# EAGLE design ESP32Shield (EAGLE 9.1.3)
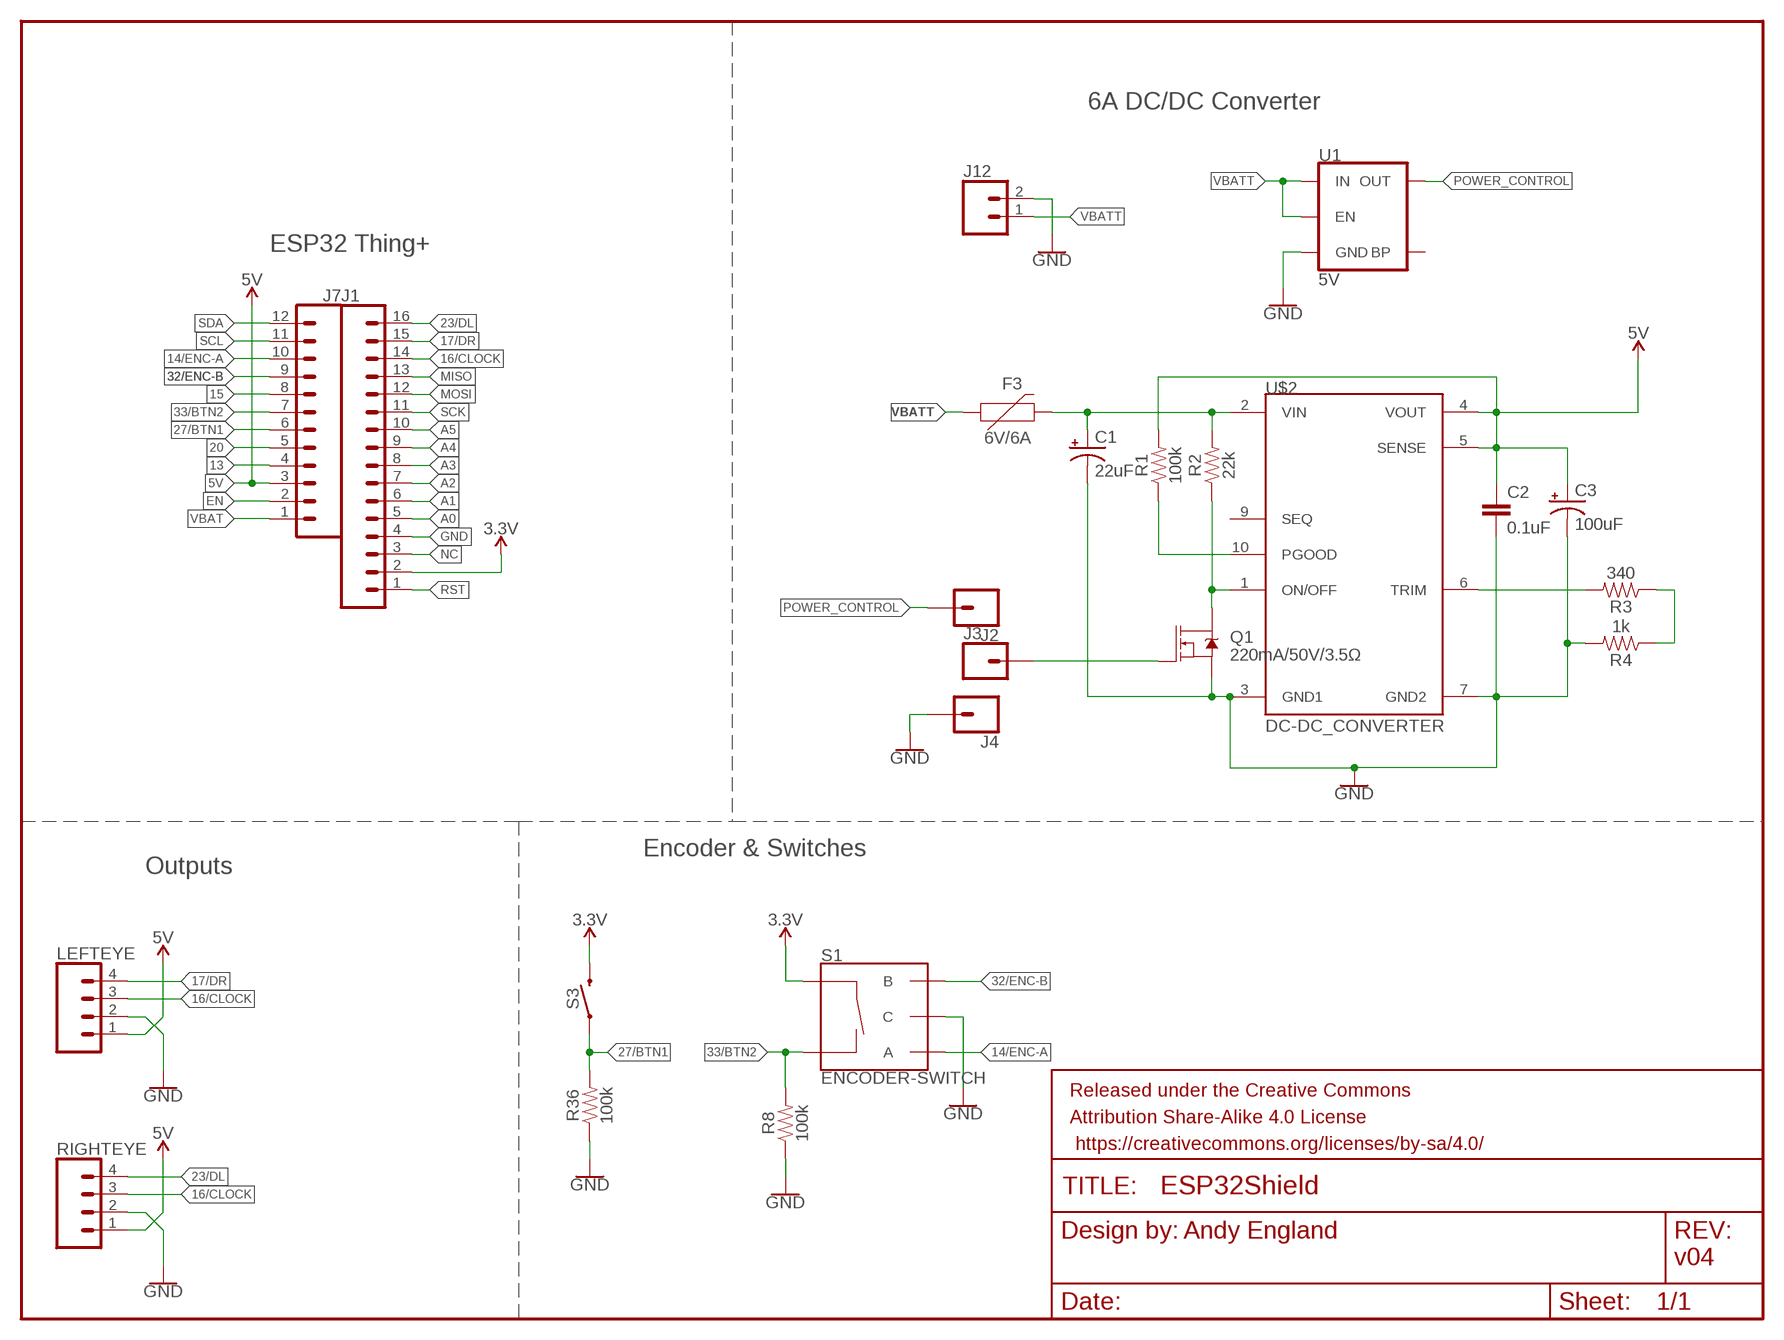
[diagram p0: schematic, sheet 1]

## Parts
C1  22uF  22UF-POLAR-PANASONIC_C-35V-20%  [PANASONIC_C]
C2  0.1uF  0.1UF-0603-25V-5%  [0603]
C3  100uF  100UF-POLAR-25V-20%(ELEC)  [PANASONIC_D]
F3  6V/6A  PPTC_HALF-AMP  [1206]
FRAME1  FRAME-LETTER  [CREATIVE_COMMONS]
J1  CONN_161X16_NO_SILK  [1X16_NO_SILK]
J2  CONN_01  [1X01]
J3  CONN_01  [1X01]
J4  CONN_01  [1X01]
J7  CONN_12NO_SILK  [1X12_NO_SILK]
J12  CONN_025MM  [SCREWTERMINAL-5MM-2]
LEFTEYE  CONN_041X04_NO_SILK  [1X04_NO_SILK]
Q1  220mA/50V/3.5Ω  MOSFET-NCH-BSS138  [SOT23-3]
R1  100k  100KOHM-0603-1/10W-1%  [0603]
R2  22k  22KOHM-0603-1/10W-1%  [0603]
R3  340  340OHM-0603-1/10W-1%  [0603]
R4  1k  1KOHM-0603-1/10W-1%  [0603]
R8  100k  100KOHM-0603-1/10W-1%  [0603]
R36  100k  100KOHM-0603-1/10W-1%  [0603]
RIGHTEYE  CONN_041X04_NO_SILK  [1X04_NO_SILK]
S1  ENCODER-SWITCH  [ROTARY_ENC_PLAIN]
S3  MOMENTARY-SWITCH-SPST-SMD-5.2-REDUNDANT  [TACTILE_SWITCH_SMD_5.2MM]
U1  5V  V_REG_MIC52055V  [SOT23-5]
U$2  DC-DC_CONVERTER  [DC-DC_CONVERTER]

## Nets
3.3V: J1.2 S1.SW+ S3.3 S3.4
5V: C2.1 C3.+ J7.3 LEFTEYE.1 R1.2 RIGHTEYE.1 U$2.4(VOUT) U$2.5(SENSE)
13: J7.4
14/ENC-A: J7.10 S1.A
15: J7.8
16/CLOCK: J1.14 LEFTEYE.3 RIGHTEYE.3
17/DR: J1.15 LEFTEYE.4
20: J7.5
23/DL: J1.16 RIGHTEYE.4
27/BTN1: J7.6 R36.2 S3.1 S3.2
32/ENC-B: J7.9 S1.B
33/BTN2: J7.7 R8.2 S1.SW-
A0: J1.5
A1: J1.6
A2: J1.7
A3: J1.8
A4: J1.9
A5: J1.10
EN: J7.2
GND: C1.- C2.2 C3.- J1.4 J4.1 J12.2 LEFTEYE.2 Q1.2(S) R4.2 R8.1 R36.1 RIGHTEYE.2 S1.C U1.2(GND) U$2.3(GND1) U$2.7(GND2)
MISO: J1.13
MOSI: J1.12
N$1: J3.1 Q1.1(G)
N$2: C1.+ F3.2 R2.2 U$2.2(VIN)
N$3: Q1.3(D) R2.1 U$2.1(ON/OFF)
N$4: R3.2 U$2.6(TRIM)
N$5: R3.1 R4.1
NC: J1.3
PGOOD3: R1.1 U$2.10(PGOOD)
POWER_CONTROL: J2.1 U1.5(OUT)
RST: J1.1
SCK: J1.11
SCL: J7.11
SDA: J7.12
VBAT: J7.1
VBATT: F3.1 J12.1 U1.1(IN) U1.3(EN)
Unconnected: U1.4(BP) U$2.9(SEQ)

## Notes on the sheet
- 6A DC/DC Converter
- ESP32 Thing+
- Encoder & Switches
- Outputs
- Andy England
- v04

## Library data of the parts
C1 = SparkFun-Capacitors:22UF-POLAR: 22µF polarized capacitors A capacitor is a passive two-terminal electrical component used to store electrical energy temporarily in an electric field.; PROD_ID: CAP-08618
C2 = SparkFun-Capacitors:0.1UF: 0.1µF ceramic capacitors A capacitor is a passive two-terminal electrical component used to store electrical energy temporarily in an electric field.; PROD_ID: CAP-08604
C3 = SparkFun-Capacitors:100UF-POLAR: 100µF polarized capacitors A capacitor is a passive two-terminal electrical component used to store electrical energy temporarily in an electric field.; PROD_ID: CAP-12547
F3 = SparkFun-Fuses:PPTC: Resettable Fuse PPTC Resettable Fuse. Really a sort of resistor with a polymeric positive temperature coefficient whose resistance increases dramatically with an increase in temperature. When heated by the power passing through the resistance rises causing the current to be limited, protecting the circuit. This is achieved by the transition of the polymer from a crystalline to an amorphous state where the conductive carbon separates breaking the conductive pathways found in the cool crystalline structure. When a PPTC cools back down it resumes conducting letting the circuit turn back on. SparkFun Products: SparkFun RedBoard - Programmed with Arduino <https://www.sparkfun.com/products/12757> Pro Micro - 5V/16MHz <https://www.sparkfun.com/products/12640> Arduino Pro 328 - 5V/16MHz <https://www.sparkfun.com/products/10915> MP3 Trigger <https://www.sparkfun.com/products/13720>; PROD_ID: RES-08585; VALUE: 6V/0.5A
FRAME1 = SparkFun-Aesthetics:FRAME-LETTER: Schematic Frame - Letter Standard 8.5x11 US Letter frame
J1 = SparkFun-Connectors:CONN_16: Multi connection point. Often used as Generic Header-pin footprint for 0.1 inch spaced/style header connections On any of the 0.1 inch spaced packages, you can populate with these: Break Away Headers - Straight <https://www.sparkfun.com/products/116> (PRT-00116) Break Away Male Headers - Right Angle <https://www.sparkfun.com/products/553> (PRT-00553) Female Headers <https://www.sparkfun.com/products/115> (PRT-00115) Break Away Headers - Machine Pin <https://www.sparkfun.com/products/117> (PRT-00117) Break Away Female Headers - Swiss Machine Pin <https://www.sparkfun.com/products/743> (PRT-00743) For SCREWTERMINALS and SPRING TERMINALS visit here: Screw Terimnals on SparkFun.com <https://www.sparkfun.com/search/results?term=Screw+Terminals> (5mm/3.5mm/2.54mm spacing) This device is also useful as a general connection point to wire up your design to another part of your project. Our various solder wires solder well into these plated through hole pads. Hook-Up Wire - Assortment (Stranded, 22 AWG) <https://www.sparkfun.com/products/11375> (PRT-11375) Hook-Up Wire - Assortment (Solid Core, 22 AWG) <https://www.sparkfun.com/products/11367> (PRT-11367) View the entire wire category on our website here <https://www.sparkfun.com/categories/141> Special notes: Molex polarized connector foot print use with SKU : PRT-08231 with associated crimp pins and housings. 1MM SMD Version SKU: PRT-10208 NOTES ON THE VARIANTS LOCK and LOCK_LONGPADS... This footprint was designed to help hold the alignment of a through-hole component (i.e. 6-pin header) while soldering it into place. You may notice that each hole has been shifted either up or down by 0.005 of an inch from it's more standard position (which is a perfectly straight line). This slight alteration caused the pins (the squares in the middle) to touch the edges of the holes. Because they are alternating, it causes a "brace" to hold the component in place. 0.005 has proven to be the perfect amount of "off-center" position when using our standard breakaway headers. Although looks a little odd when you look at the bare footprint, once you have a header in there, the alteration is very hard to notice. Also,if you push a header all the way into place, it is covered up entirely on the bottom side.
J2-J4 = SparkFun-Connectors:CONN_01: Single connection point. Often used as Generic Header-pin footprint for 0.1 inch spaced/style header connections On any of the 0.1 inch spaced packages, you can populate with these: Break Away Headers - Straight <https://www.sparkfun.com/products/116> (PRT-00116) Break Away Male Headers - Right Angle <https://www.sparkfun.com/products/553> (PRT-00553) Female Headers <https://www.sparkfun.com/products/115> (PRT-00115) Break Away Headers - Machine Pin <https://www.sparkfun.com/products/117> (PRT-00117) Break Away Female Headers - Swiss Machine Pin <https://www.sparkfun.com/products/743> (PRT-00743) This device is also useful as a general connection point to wire up your design to another part of your project. Our various solder wires solder well into these plated through hole pads. Hook-Up Wire - Assortment (Stranded, 22 AWG) <https://www.sparkfun.com/products/11375> (PRT-11375) Hook-Up Wire - Assortment (Solid Core, 22 AWG) <https://www.sparkfun.com/products/11367> (PRT-11367) View the entire wire category on our website here <https://www.sparkfun.com/categories/141> Special notes: SMTSO-256-ET is a "flush mount" nut for a 4-40 screw. We mostly use this on specialty testbeds; it is a nice way to connect hardware to your PCB at an adjustable hieght. Also note, the SNAP packages are for using a snappable style connector. We sell a baggie of snaps and they are also used on two LilyPad designs: Snap Assortment - 30 pack (male and female) <https://www.sparkfun.com/products/11347> (DEV-11347) LilyPad Arduino SimpleSnap <https://www.sparkfun.com/products/10941> (DEV-10941) LilyPad SimpleSnap Protoboard <https://www.sparkfun.com/products/10940> (DEV-10940)
J7 = SparkFun-Connectors:CONN_12: Multi connection point. Often used as Generic Header-pin footprint for 0.1 inch spaced/style header connections On any of the 0.1 inch spaced packages, you can populate with these: Break Away Headers - Straight <https://www.sparkfun.com/products/116> (PRT-00116) Break Away Male Headers - Right Angle <https://www.sparkfun.com/products/553> (PRT-00553) Female Headers <https://www.sparkfun.com/products/115> (PRT-00115) Break Away Headers - Machine Pin <https://www.sparkfun.com/products/117> (PRT-00117) Break Away Female Headers - Swiss Machine Pin <https://www.sparkfun.com/products/743> (PRT-00743) For SCREWTERMINALS and SPRING TERMINALS visit here: Screw Terimnals on SparkFun.com <https://www.sparkfun.com/search/results?term=Screw+Terminals> (5mm/3.5mm/2.54mm spacing) This device is also useful as a general connection point to wire up your design to another part of your project. Our various solder wires solder well into these plated through hole pads. Hook-Up Wire - Assortment (Stranded, 22 AWG) <https://www.sparkfun.com/products/11375> (PRT-11375) Hook-Up Wire - Assortment (Solid Core, 22 AWG) <https://www.sparkfun.com/products/11367> (PRT-11367) View the entire wire category on our website here <https://www.sparkfun.com/categories/141> Special notes: Molex polarized connector foot print use with SKU : PRT-08231 with associated crimp pins and housings. 1MM SMD Version SKU: PRT-10208 NOTES ON THE VARIANTS LOCK and LOCK_LONGPADS... This footprint was designed to help hold the alignment of a through-hole component (i.e. 6-pin header) while soldering it into place. You may notice that each hole has been shifted either up or down by 0.005 of an inch from it's more standard position (which is a perfectly straight line). This slight alteration caused the pins (the squares in the middle) to touch the edges of the holes. Because they are alternating, it causes a "brace" to hold the component in place. 0.005 has proven to be the perfect amount of "off-center" position when using our standard breakaway headers. Although looks a little odd when you look at the bare footprint, once you have a header in there, the alteration is very hard to notice. Also,if you push a header all the way into place, it is covered up entirely on the bottom side.
J12 = SparkFun-Connectors:CONN_02: Multi connection point. Often used as Generic Header-pin footprint for 0.1 inch spaced/style header connections On any of the 0.1 inch spaced packages, you can populate with these: Break Away Headers - Straight <https://www.sparkfun.com/products/116> (PRT-00116) Break Away Male Headers - Right Angle <https://www.sparkfun.com/products/553> (PRT-00553) Female Headers <https://www.sparkfun.com/products/115> (PRT-00115) Break Away Headers - Machine Pin <https://www.sparkfun.com/products/117> (PRT-00117) Break Away Female Headers - Swiss Machine Pin <https://www.sparkfun.com/products/743> (PRT-00743) For SCREWTERMINALS and SPRING TERMINALS visit here: Screw Terimnals on SparkFun.com <https://www.sparkfun.com/search/results?term=Screw+Terminals> (5mm/3.5mm/2.54mm spacing) This device is also useful as a general connection point to wire up your design to another part of your project. Our various solder wires solder well into these plated through hole pads. Hook-Up Wire - Assortment (Stranded, 22 AWG) <https://www.sparkfun.com/products/11375> (PRT-11375) Hook-Up Wire - Assortment (Solid Core, 22 AWG) <https://www.sparkfun.com/products/11367> (PRT-11367) View the entire wire category on our website here <https://www.sparkfun.com/categories/141> Special notes: Molex polarized connector foot print use with: PRT-08233 with associated crimp pins and housings. 2.54_SCREWTERM for use with PRT-10571. 3.5mm Screw Terminal footprints for PRT-08084 5mm Screw Terminal footprints for use with PRT-08432; SF_SKU: PRT-08432
LEFTEYE RIGHTEYE = SparkFun-Connectors:CONN_04: Multi connection point. Often used as Generic Header-pin footprint for 0.1 inch spaced/style header connections On any of the 0.1 inch spaced packages, you can populate with these: Break Away Headers - Straight <https://www.sparkfun.com/products/116> (PRT-00116) Break Away Male Headers - Right Angle <https://www.sparkfun.com/products/553> (PRT-00553) Female Headers <https://www.sparkfun.com/products/115> (PRT-00115) Break Away Headers - Machine Pin <https://www.sparkfun.com/products/117> (PRT-00117) Break Away Female Headers - Swiss Machine Pin <https://www.sparkfun.com/products/743> (PRT-00743) For SCREWTERMINALS and SPRING TERMINALS visit here: Screw Terimnals on SparkFun.com <https://www.sparkfun.com/search/results?term=Screw+Terminals> (5mm/3.5mm/2.54mm spacing) This device is also useful as a general connection point to wire up your design to another part of your project. Our various solder wires solder well into these plated through hole pads. Hook-Up Wire - Assortment (Stranded, 22 AWG) <https://www.sparkfun.com/products/11375> (PRT-11375) Hook-Up Wire - Assortment (Solid Core, 22 AWG) <https://www.sparkfun.com/products/11367> (PRT-11367) View the entire wire category on our website here <https://www.sparkfun.com/categories/141> Special notes: Molex polarized connector foot print use with SKU : PRT-08231 with associated crimp pins and housings. 1MM SMD Version SKU: PRT-10208; PROD_ID: CONN-09696
Q1 = SparkFun-DiscreteSemi:MOSFET-NCH: N-channel MOSFETs Voltage controlled devices that allow control of high current outputs. SparkFun Products: SparkFun OpenScale <https://www.sparkfun.com/products/13261> SparkFun Digital Sandbox <https://www.sparkfun.com/products/12651> SparkFun Monster Moto Shield <https://www.sparkfun.com/products/10182> SparkFun MOSFET Power Controller <https://www.sparkfun.com/products/11214>; PROD_ID: TRANS-00830
R1 R8 R36 = SparkFun-Resistors:100KOHM: 100kΩ resistor A resistor is a passive two-terminal electrical component that implements electrical resistance as a circuit element. Resistors act to reduce current flow, and, at the same time, act to lower voltage levels within circuits. - Wikipedia; PROD_ID: RES-07828
R2 = SparkFun-Resistors:22KOHM: 22kΩ resistor A resistor is a passive two-terminal electrical component that implements electrical resistance as a circuit element. Resistors act to reduce current flow, and, at the same time, act to lower voltage levels within circuits. - Wikipedia; PROD_ID: RES-07853
R3 = SparkFun-Resistors:340OHM: 340Ω resistor A resistor is a passive two-terminal electrical component that implements electrical resistance as a circuit element. Resistors act to reduce current flow, and, at the same time, act to lower voltage levels within circuits. - Wikipedia; PROD_ID: RES-12616
R4 = SparkFun-Resistors:1KOHM: 1kΩ resistor A resistor is a passive two-terminal electrical component that implements electrical resistance as a circuit element. Resistors act to reduce current flow, and, at the same time, act to lower voltage levels within circuits. - Wikipedia; PROD_ID: RES-07856
S1 = SparkFun-Switches:ENCODER-SWITCH: Rotary Encoder w/ Select Switch Encoders rotate similarly to potentiometers, but they’re different from potentiometers in that an encoder has full rotation without limits. They output gray code so that you can tell how much and in which direction the encoder has been turned. This encoder includes a push-down select switch built into the shaft. SparkFun Products Rotary Encoder <https://www.sparkfun.com/products/9117> (COM-09117); SF_SKU: COM-09117
S3 = SparkFun-Switches:MOMENTARY-SWITCH-SPST: Momentary Switch (Pushbutton) - SPST Normally-open (NO) SPST momentary switches (buttons, pushbuttons). Variants PTH-12MM - 12mm square, through-hole Momentary Pushbutton Switch - 12mm Square <https://www.sparkfun.com/products/9190> (COM-09190) PTH-6.0MM, PTH-6.0MM-KIT - 6.0mm square, through-hole Mini Pushbutton Switch <https://www.sparkfun.com/products/97> (COM-00097) KIT package intended for soldering kit's - only one side of pads' copper is exposed. PTH-RIGHT-ANGLE-KIT - Right-angle, through-hole Right Angle Tactile Button <https://www.sparkfun.com/products/10791> - Used on SparkFun BigTime Watch Kit <https://www.sparkfun.com/products/11734> SMD-12MM - 12mm square, surface-mount Tactile Button - SMD (12mm) <https://www.sparkfun.com/products/12993> (COM-12993) Used on SparkFun PicoBoard <https://www.sparkfun.com/products/11888> SMD-4.5MM - 4.5mm Square Trackball Switch Used on SparkFun Blackberry Trackballer Breakout <https://www.sparkfun.com/products/13169> SMD-4.6MMX2.8MM - 4.60mm x 2.80mm, surface mount Used on SparkFun SAMD21 Mini Breakout <https://www.sparkfun.com/products/13664> SMD-5.2MM, SMD-5.2-REDUNDANT - 5.2mm square, surface-mount Mini Pushbutton Switch - SMD <https://www.sparkfun.com/products/8720> (COM-08720) Used on Arduino Pro Mini <https://www.sparkfun.com/products/11114> REDUNDANT package connects both switch circuits together SMD-6.0X3.5MM - 6.0 x 3.5mm, surface mount Momentary Reset Switch SMD <https://www.sparkfun.com/products/8229> (COM-08229) SMD-6.2MM-TALL - 6.2mm square, surface mount Tactile Button - SMD (6mm) <https://www.sparkfun.com/products/12992> Used on SparkFun Digital Sandbox <https://www.sparkfun.com/products/12651> SMD-RIGHT-ANGLE - Right-angle, surface mount Used on SparkFun Block for Intel® Edison - Arduino <https://www.sparkfun.com/products/13036>; PROD_ID: SWCH-08247; SF_SKU: COM-08720
U1 = SparkFun-IC-Power:V_REG_MIC5205: V_REG MIC5205 Standard 3.3V, 5V, and Adjustable 150mA LDO voltage regulator in SOT-23 layout. Micrel part MIC5205. BP (by-pass) pin is used to lower output noise with 470pF cap, may be left open. On the adjustable version BP is used to set output.; PROD_ID: VREG-00823
U$2 = SparkFun-IC-Power:DC-DC_CONVERTER: APTS006A0X-SRZ (IC-09258) Step-down 6A variable voltage switching module (TOL-09275)

## Board
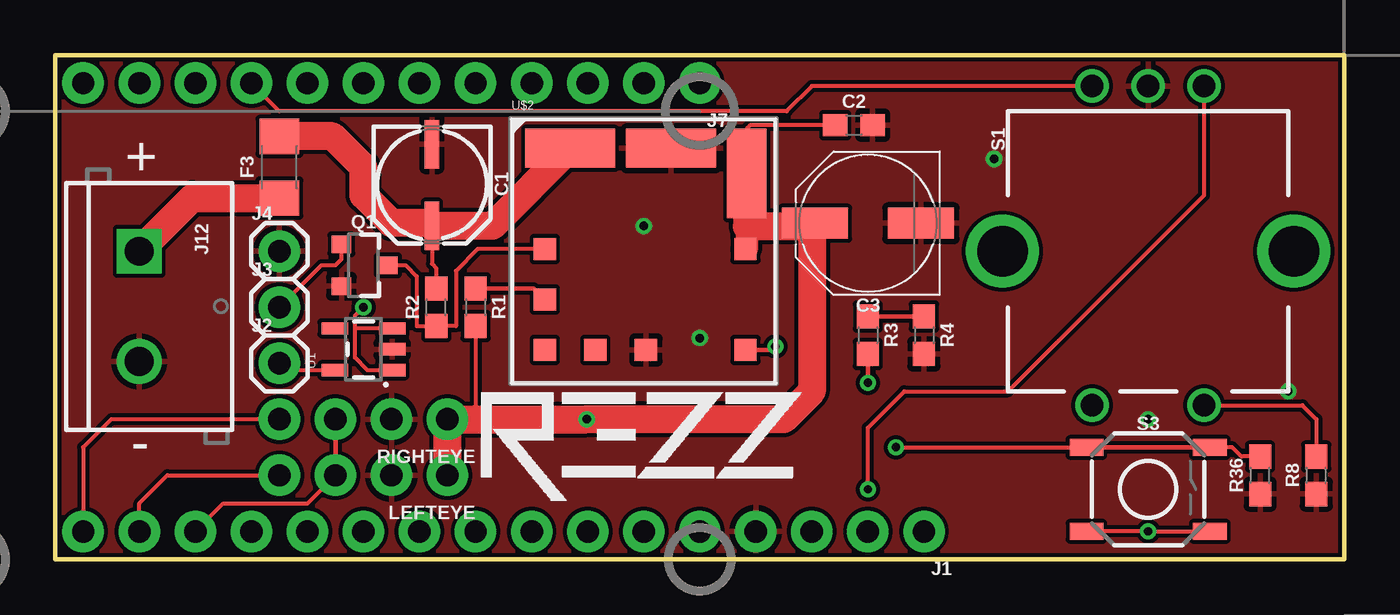
[diagram p1: board, top side]
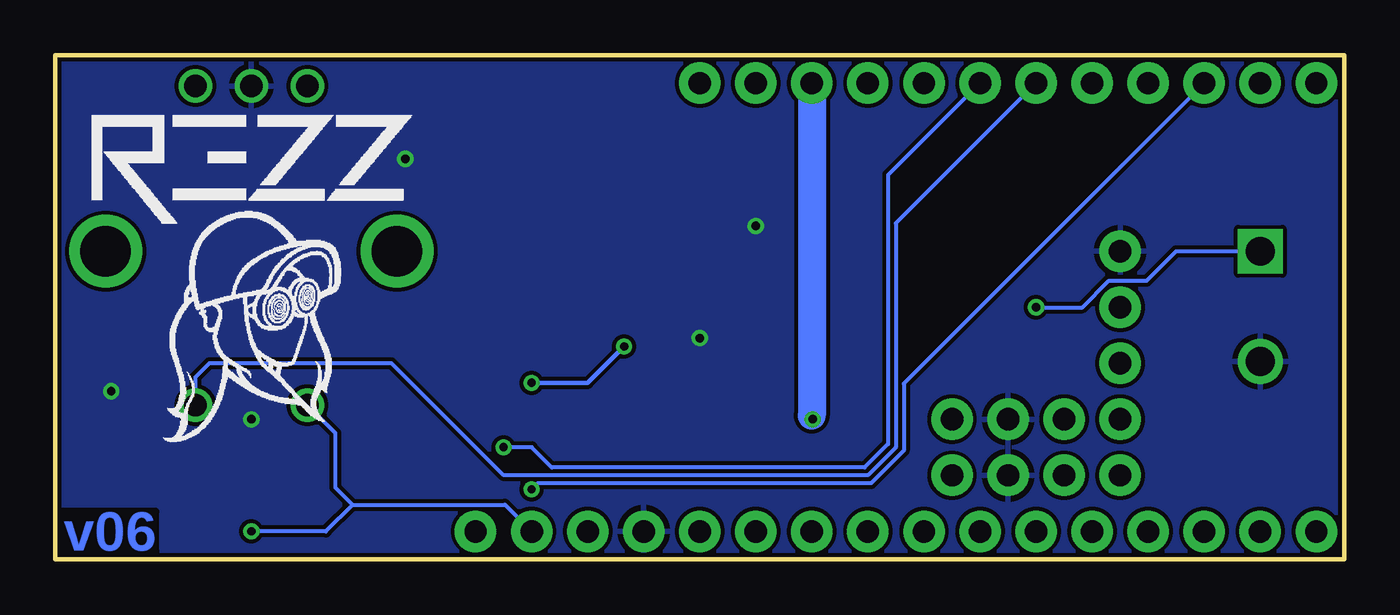
[diagram p2: board, bottom side, seen from below]

Size 58.42 x 22.86 mm. Coordinates in mm from the lower left corner, seen from the top.
Outline: 0,0 58.42,0 58.42,22.86 0,22.86 0,0
Copper layers (1*16): Top 0.035mm / dielectric 1.5mm / Bottom 0.035mm
Design rules "SparkFun-2-layer-TIGHT": minimum track width 7mil, minimum drill 15mil, track to track 7mil, track to pad 7mil, pad to pad 7mil, via to via 7mil, smd to smd 7mil, copper to edge 7mil, drill to drill 7mil, minimum pad ring 7mil, minimum via ring 7mil, stop-mask expansion 4mil, vias tented up to drill 25mil, thermal gap 10mil

### Footprints (pad centres in the part's own frame; a part is rotated, then mirrored left to right if it is on the bottom)
PANASONIC_C = smd 2.2 x 0.65: + 1.9,-0.2; - -1.8,-0.2
0603 = smd 1.1 x 1: 1 -0.85,0; 2 0.85,0
PANASONIC_D = smd 3 x 1.4: + 2.4,0; - -2.4,0
1206 = smd 1.6 x 1.8: 1 -1.4,0; 2 1.4,0
1X16_NO_SILK = drill 1.016 pad 1.88: 1 0,0; 2 2.54,0; 3 5.08,0; 4 7.62,0; 5 10.16,0; 6 12.7,0; 7 15.24,0; 8 17.78,0; 9 20.32,0; 10 22.86,0; 11 25.4,0; 12 27.94,0; 13 30.48,0; 14 33.02,0; 15 35.56,0; 16 38.1,0
1X01 = drill 1.016 pad 1.88: 1 0,0
1X12_NO_SILK = drill 1.016 pad 1.88: 1 0,0; 2 2.54,0; 3 5.08,0; 4 7.62,0; 5 10.16,0; 6 12.7,0; 7 15.24,0; 8 17.78,0; 9 20.32,0; 10 22.86,0; 11 25.4,0; 12 27.94,0
SCREWTERMINAL-5MM-2 = drill 1.3 pad 2.032 square: 1 0,0 | drill 1.3 pad 2.032: 2 5,0
1X04_NO_SILK = drill 1.016 pad 1.88: 1 0,0; 2 2.54,0; 3 5.08,0; 4 7.62,0
SOT23-3 = smd 0.8 x 0.9: 1 -0.95,-1; 2 0.95,-1; 3 0,1.1
ROTARY_ENC_PLAIN = drill 1.016: A 7.493,-2.54; B 7.493,2.54; C 7.493,0; SW+ -6.985,2.54; SW- -6.985,-2.54 | drill 2.286: P$3 0,6.604; P$4 0,-6.604
TACTILE_SWITCH_SMD_5.2MM = smd 1.524 x 0.762: 1 -2.794,1.905; 2 2.794,1.905; 3 -2.794,-1.905; 4 2.794,-1.905
SOT23-5 = smd 0.55 x 1.2: 1 -0.95,-1.3; 2 0,-1.3; 3 0.95,-1.3; 4 0.95,1.3; 5 -0.95,1.3
DC-DC_CONVERTER = smd 1.01 x 1.01: 1 -4.48,0.1; 5 4.61,0.1; 6 4.61,-4.48; 7 0.1,-4.48; 8 -2.19,-4.48; 9 -4.48,-4.48; 10 -4.48,-2.19 | smd 4.07 x 1.77: 2 -3.33,4.67; 3 1.24,4.67 | smd 1.77 x 4.07: 4 4.67,3.53

### Placement (x,y rotation side)
C1  17.27,17.02 270 top
C2  36.2,19.68 0 top
C3  36.83,15.24 180 top
F3  10.16,17.78 90 top
FRAME1  -2.54,-7.62 0 top  (outside the outline)
J1  39.37,1.27 180 top
J2  10.16,8.89 0 top
J3  10.16,11.43 0 top
J4  10.16,13.97 0 top
J7  29.21,21.59 180 top
J12  3.81,13.97 270 top
LEFTEYE  17.78,3.81 180 top
Q1  13.97,13.34 270 top
R1  19.05,11.43 270 top
R2  17.27,11.43 90 top
R3  36.83,10.16 270 top
R4  39.37,10.16 270 top
R8  57.15,3.81 90 top
R36  54.61,3.81 90 top
RIGHTEYE  17.78,6.35 180 top
S1  49.53,13.97 90 top
S3  49.53,3.17 0 top
U1  13.97,9.53 90 top
U$1  [SWBADNC#JPG]  26.57,5.11 0 top
U$2  26.67,13.97 0 top
U$3  [FB847930393B0F397FC054233C2D7CC6F23D0E39#JPG]  49.4,9.91 0 bottom
U$4  [SWBADNC#JPG]  49.49,17.69 0 bottom

### Tracks (layer width: path | path; a pad name or v marks a point on that pad's centre or on a via)
3.3V  (via drill 0.38)
  Top 0.178: S3.4 52.07,1.27 v49.53,1.27 46.99,1.27 S3.3
  Bottom 0.178: v49.53,1.27 46.16,1.27 44.95,2.48 | 44.95,2.48 45.72,3.25 45.72,5.71 S1.SW+ | 44.95,2.48 38.04,2.48 J1.2
5V  (via drill 0.38)
  Top 0.178: C2.1 31.5,19.68 31.37,19.56 31.37,17.53 U$2.4 | 19.1,10.53 R1.2 19.05,6.35
  Top 1.016: U$2.5 arc90 31.34,14.13 U$2.4
  Top 1.27: U$2.4 31.34,15.1 34.29,15.1 | C3.+ 34.29,15.1 | 34.29,15.1 34.29,7.62 33.02,6.35 v24.09,6.35 19.05,6.35 RIGHTEYE.1 LEFTEYE.1
  Bottom 0.178: 24.13,6.52 24.09,6.48 v24.09,6.35
  Bottom 1.27: J7.3 24.13,6.52
14/ENC-A  (via drill 0.38)
  Top 0.178: v36.83,3.17 36.83,5.97 38.48,7.62 43.18,7.62 52.07,16.51 S1.A
  Bottom 0.178: J7.10 19.96,7.98 19.96,4.93 21.44,3.45 36.55,3.45 v36.83,3.17
16/CLOCK
  Top 0.178: J1.14 7.62,2.54 11.43,2.54 LEFTEYE.3
  Top 0.203: RIGHTEYE.3 LEFTEYE.3
17/DR
  Top 0.178: J1.15 3.81,2.54 5.08,3.81 LEFTEYE.4
23/DL
  Top 0.178: J1.16 1.27,5.08 2.54,6.35 RIGHTEYE.4
27/BTN1  (via drill 0.38)
  Top 0.178: S3.2 53.34,5.08 53.76,4.66 R36.2 | v38.1,5.08 S3.1
  Top 0.203: S3.2 50.16,5.08 49.53,5.08 48.9,5.08 48.01,5.08 S3.1
  Bottom 0.178: J7.6 20.68,17.42 20.68,5.23 21.74,4.17 35.92,4.17 36.83,5.08 v38.1,5.08
32/ENC-B
  Top 0.178: J7.9 10.16,20.32 33.15,20.32 34.29,21.46 S1.B
33/BTN2
  Top 0.178: S1.SW- 56.52,6.99 57.15,6.35 R8.2
  Bottom 0.178: J7.7 20.32,15.24 20.32,5.08 21.59,3.81 38.1,3.81 43.18,8.89 51.44,8.89 52.07,8.26 S1.SW-
GND  (via drill 0.38)
  other vias: 29.21,10.03 42.55,18.16 26.67,15.11 55.88,7.62 49.53,6.35
  pour Bottom: 0,22.86 58.42,22.86 58.42,0 0,0
  pour Top: 58.42,22.86 0,22.86 0,0 58.42,0
N$1
  Top 0.178: J3.1 12.06,13.34 12.7,13.34 12.97,13.61 Q1.1
N$2
  Top 0.178: C1.+ 17.07,13.41 17.27,13.21 R2.2
  Top 1.27: F3.2 12.57,19.18 13.97,17.78 13.97,16.51 15.24,15.24 16.95,15.24 C1.+ 19.82,15.12 U$2.2
N$3
  Top 0.178: U$2.1 19.15,14.07 18.16,13.08 18.16,10.58 R2.1 16.38,10.58 16.38,12.83 15.88,13.34 Q1.3
N$4  (via drill 0.38)
  Top 0.203: U$2.6 32.48,9.49 v32.64,9.65 | v36.83,8 R3.2
  Bottom 0.203: v36.83,8 34.29,8 v32.64,9.65
N$5
  Top 0.203: R4.1 R3.1
PGOOD3
  Top 0.203: R1.1 21.69,12.28 U$2.10
POWER_CONTROL
  Top 0.178: U1.5 10.47,8.57 J2.1
VBATT  (via drill 0.38)
  Top 0.178: U1.1 14.16,8.57 13.59,9.14 13.59,10.41 | 13.59,10.41 13.59,11.05 v13.97,11.43 | U1.3 13.65,10.47 13.59,10.41
  Top 1.27: J12.1 6.22,16.38 F3.1
  Bottom 0.178: v13.97,11.43 11.87,11.43 10.66,12.64 8.95,12.64 7.62,13.97 J12.1

### Text on the board
Bottom: v06
tPlace: + | -
tDocu: Andy England